# EasyEDA schematic hand.json
TITLE: Sheet_1; REV: 1.0; Date: 2021-05-18; Sheet: 1/1; Company: Your Company
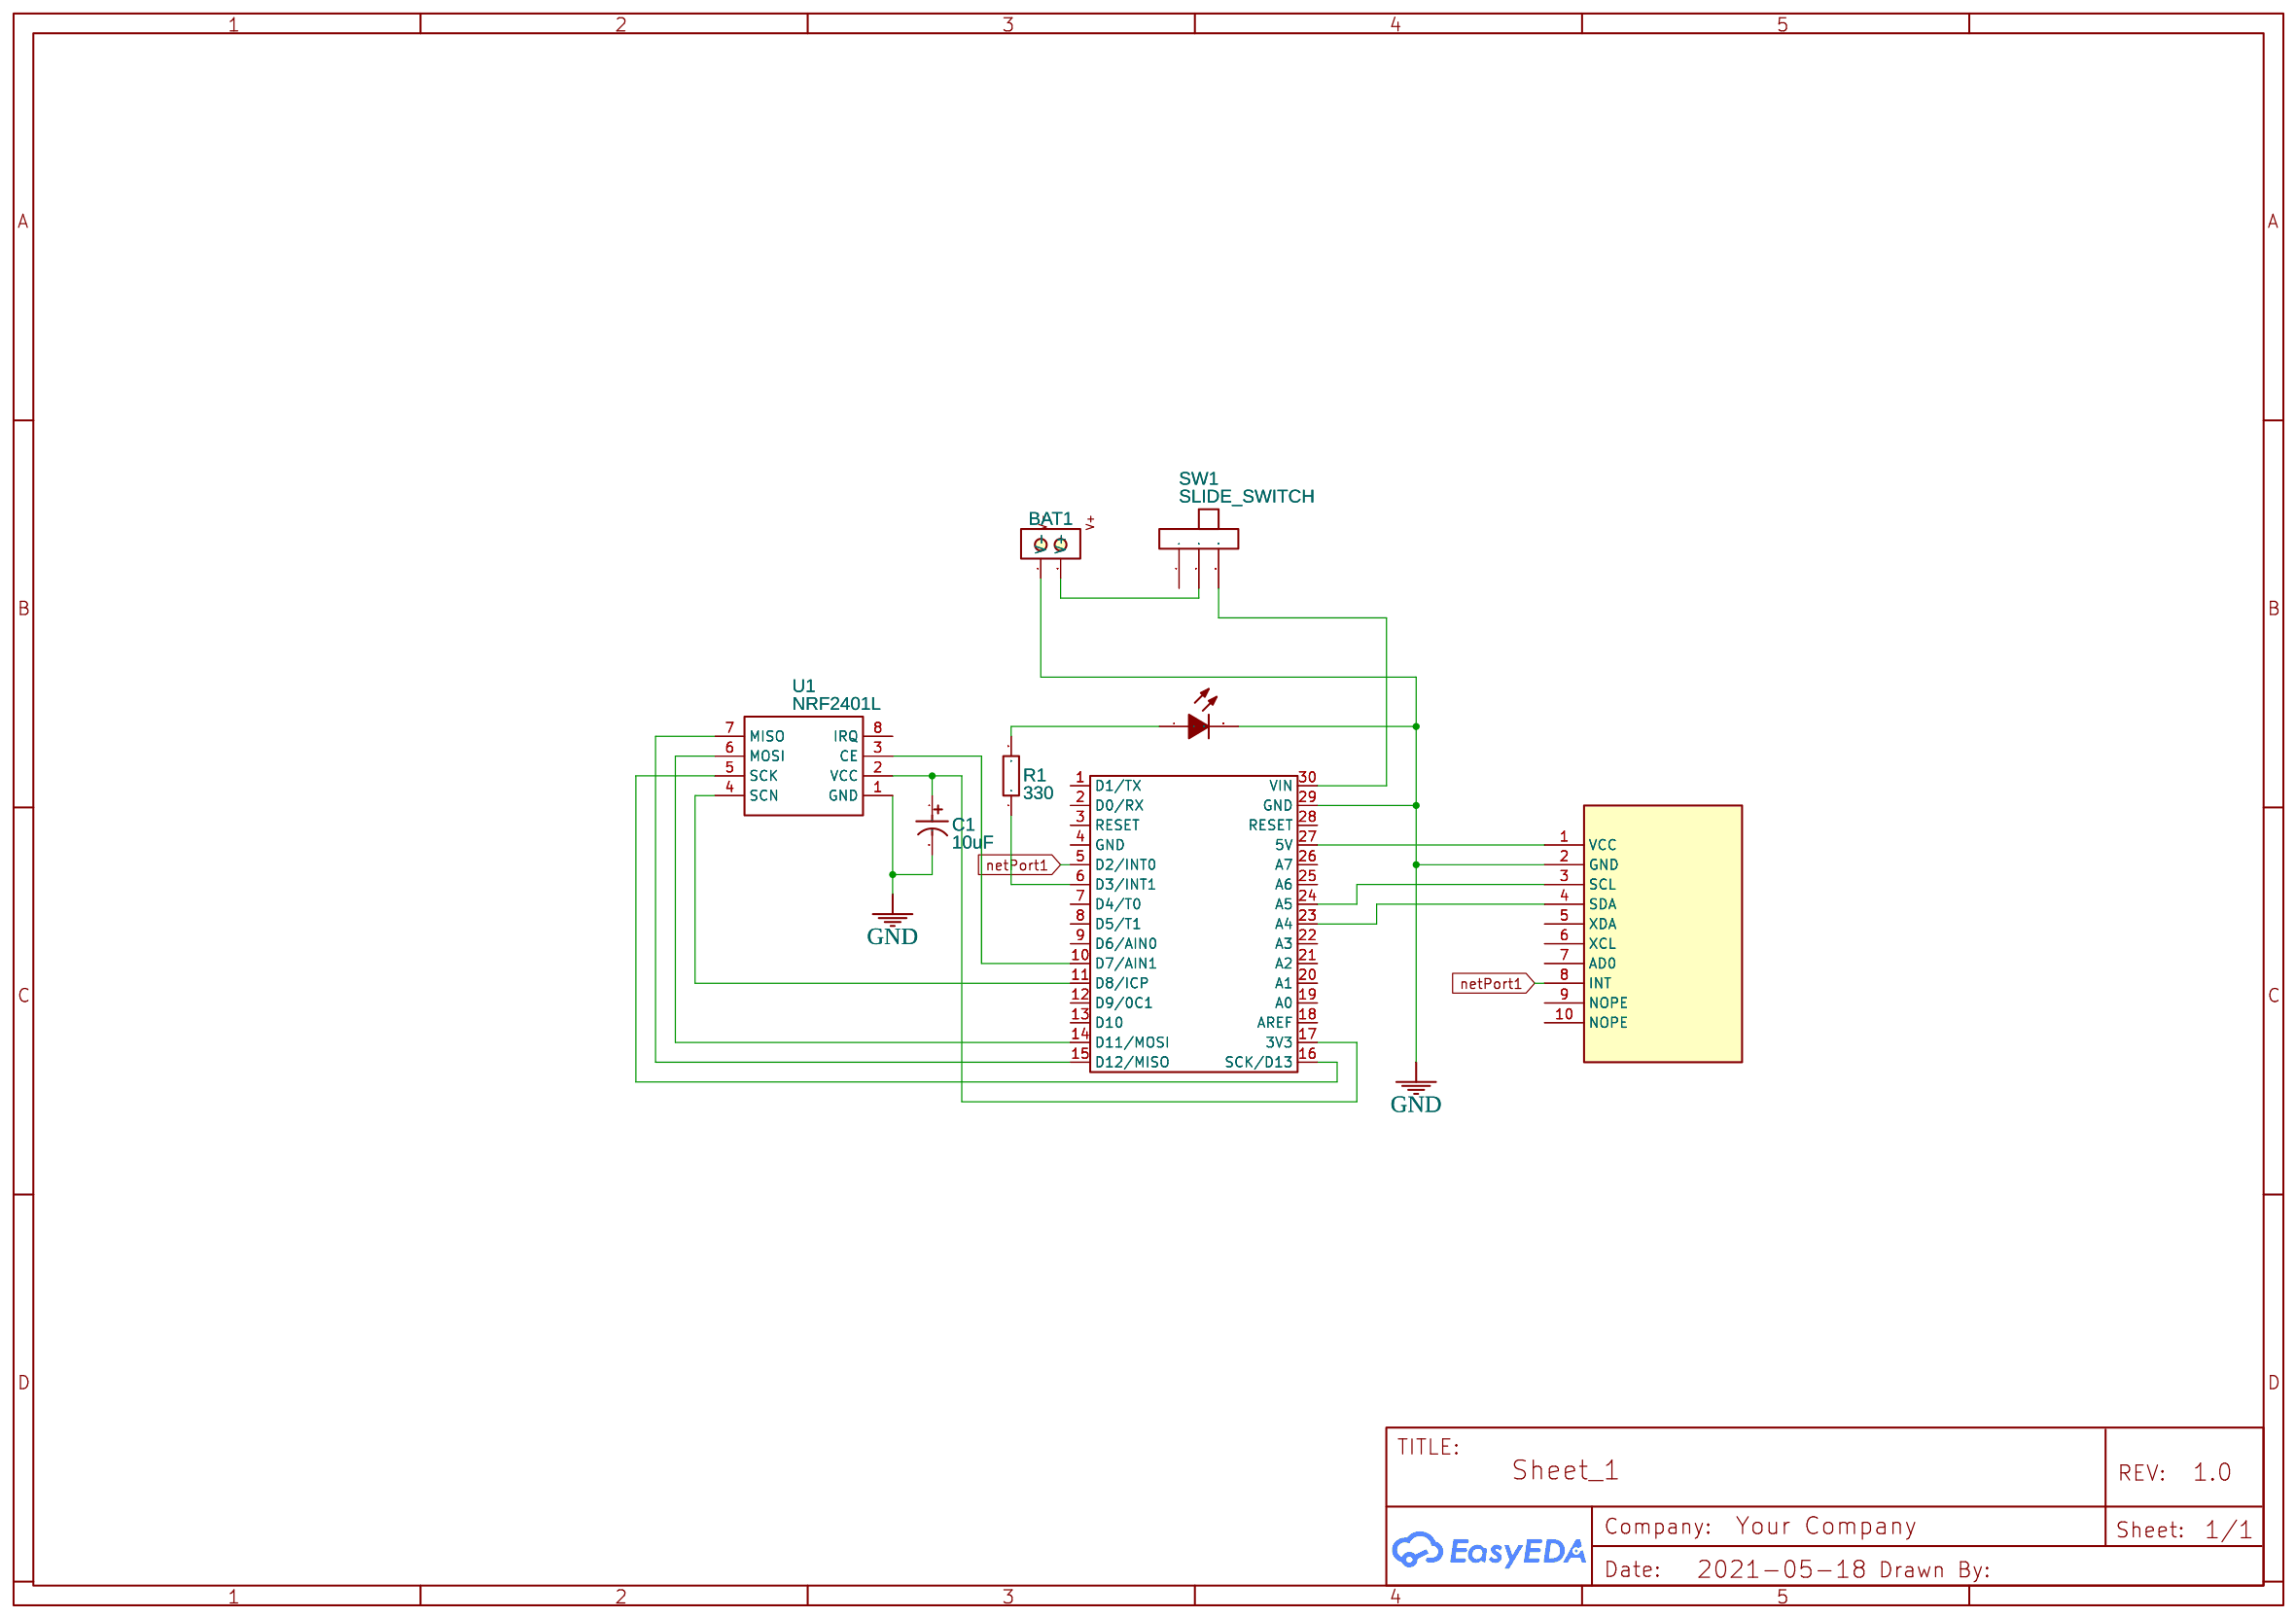
[diagram p0: schematic sheet]

## Parts
BAT1  9V Battery cable connector  [9V BATERRY CABLE CONNECTOR]
C1  10uF  [CAP-TH_BD4.0-P1.50-D0.8-FD]
J1  Arduino_Nano_Header  [DIP-30_L43.18-W15.24-ARDUINONANO]
LED1  φ3 Red  [LED-TH_BD3.5-P2.54-FD]
P1  MPU6050  [MPU6050]
R1  330  [RES-TH_BD1.8-L3.2-P7.20-D0.4]
SW1  SLIDE_SWITCH  [SPDT]
U1  NRF2401L  [NRF2401L]

## Library data of the parts
BAT1 = 9V Battery cable connector: Contributor: Janosch_89
C1 = electrolytic capacitor10UF50V: Supplier: LCSC; Manufacturer: ValuePro; Supplier Part: C32856
J1 = Arduino_Nano_Header
LED1 = φ3 Red: Supplier: LCSC; Manufacturer: KENTO; image: //image.lceda.cn/szlcsc/C39928.jpg; Supplier Part: C39928
P1 = MPU6050: sourceId: 1T5FDZYC8
R1 = MF1/8W ±1% 330Ω OTB5: Supplier: LCSC; Supplier Part: C337130; Manufacturer: FlyWin; Contributor: LCSC; JLCPCB Part Class: Extended Part
SW1 = SLIDE_SWITCH: Manufacturer Part: slide switch; Supplier Part: 401-1999-1-ND; link: https://www.digikey.com/products/en?keywords=401-1999-1-ND; Contributor: Gugunia Pięćdziesiątjeden
U1 = NRF2401L: Manufacturer Part: nrf2401l; Contributor: ufb769

## Nets
GND: BAT1.1(V-) C1.2(-) J1.29(GND) LED1.2(C) P1.2(GND) U1.1(GND)
netPort1: J1.5(D2/INT0) P1.8(INT)
Net-(BAT1-2): BAT1.2(V+) SW1.2
Net-(C1-1): C1.1(+) J1.17(3V3) U1.2(VCC)
Net-(J1-6): J1.6(D3/INT1) R1.1
Net-(J1-10): J1.10(D7/AIN1) U1.3(CE)
Net-(J1-11): J1.11(D8/ICP) U1.4(SCN)
Net-(J1-14): J1.14(D11/MOSI) U1.6(MOSI)
Net-(J1-15): J1.15(D12/MISO) U1.7(MISO)
Net-(J1-16): J1.16(SCK/D13) U1.5(SCK)
Net-(J1-23): J1.23(A4) P1.4(SDA)
Net-(J1-24): J1.24(A5) P1.3(SCL)
Net-(J1-27): J1.27(5V) P1.1(VCC)
Net-(J1-30): J1.30(VIN) SW1.3
Net-(LED1-1): LED1.1(A) R1.2

Not connected (* = marked no-connect by the designer): J1 1(D1/TX) 2(D0/RX) 3(RESET) 4(GND) 7(D4/T0) 8(D5/T1) 9(D6/AIN0) 12(D9/0C1) 13(D10) 18(AREF) 19(A0) 20(A1) 21(A2) 22(A3) 25(A6) 26(A7) 28(RESET); P1 5(XDA) 6(XCL) 7(AD0) 9(NOPE) 10(NOPE); SW1 1; U1 8(IRQ)
